# EAGLE design DynoUSB_10 (EAGLE 6.5.0)
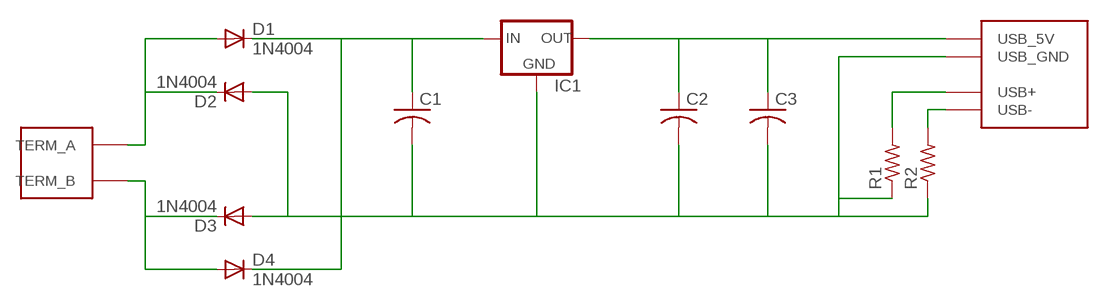
[diagram p0: schematic, sheet 1]

## Parts
C1  C-USC1206  [C1206]
C2  C-USC1206  [C1206]
C3  C-USC3216  [C3216]
D1  1N4004  [DO41-10]
D2  1N4004  [DO41-10]
D3  1N4004  [DO41-10]
D4  1N4004  [DO41-10]
IC1  78XXL  [78XXL]
R1  R-US_M1206  [M1206]
R2  R-US_M1206  [M1206]
U$1  SPARKFUN_USB_A  [USB_4UCON_18666_318]
U$2  SCREW_TERM_2  [SCREWTERMINAL-5MM-2]

## Nets
N$1: D1.A D2.C U$2.1(TERM_A)
N$2: D3.C D4.A U$2.2(TERM_B)
N$3: C2.1 C3.1 IC1.OUT U$1.USB_5V
N$4: C1.1 D1.C D4.C IC1.IN
N$5: C1.2 C2.2 C3.2 D2.A D3.A IC1.GND R1.1 R2.1 U$1.USB_GND
N$6: R1.2 U$1.USB+
N$7: R2.2 U$1.USB-

## Library data of the parts
C1-C3 = rcl:C-US: CAPACITOR, American symbol
D1-D4 = diode:1N4004: DIODE general purpose rectifier, 1 A
IC1 = v-reg:78XXL: VOLTAGE REGULATOR
R1 R2 = resistor:R-US_: RESISTOR, American symbol
U$1 = sparkfun-usb-a:SPARKFUN_USB_A
U$2 = sparkfun-usb-a:SCREW_TERM_2

## Board
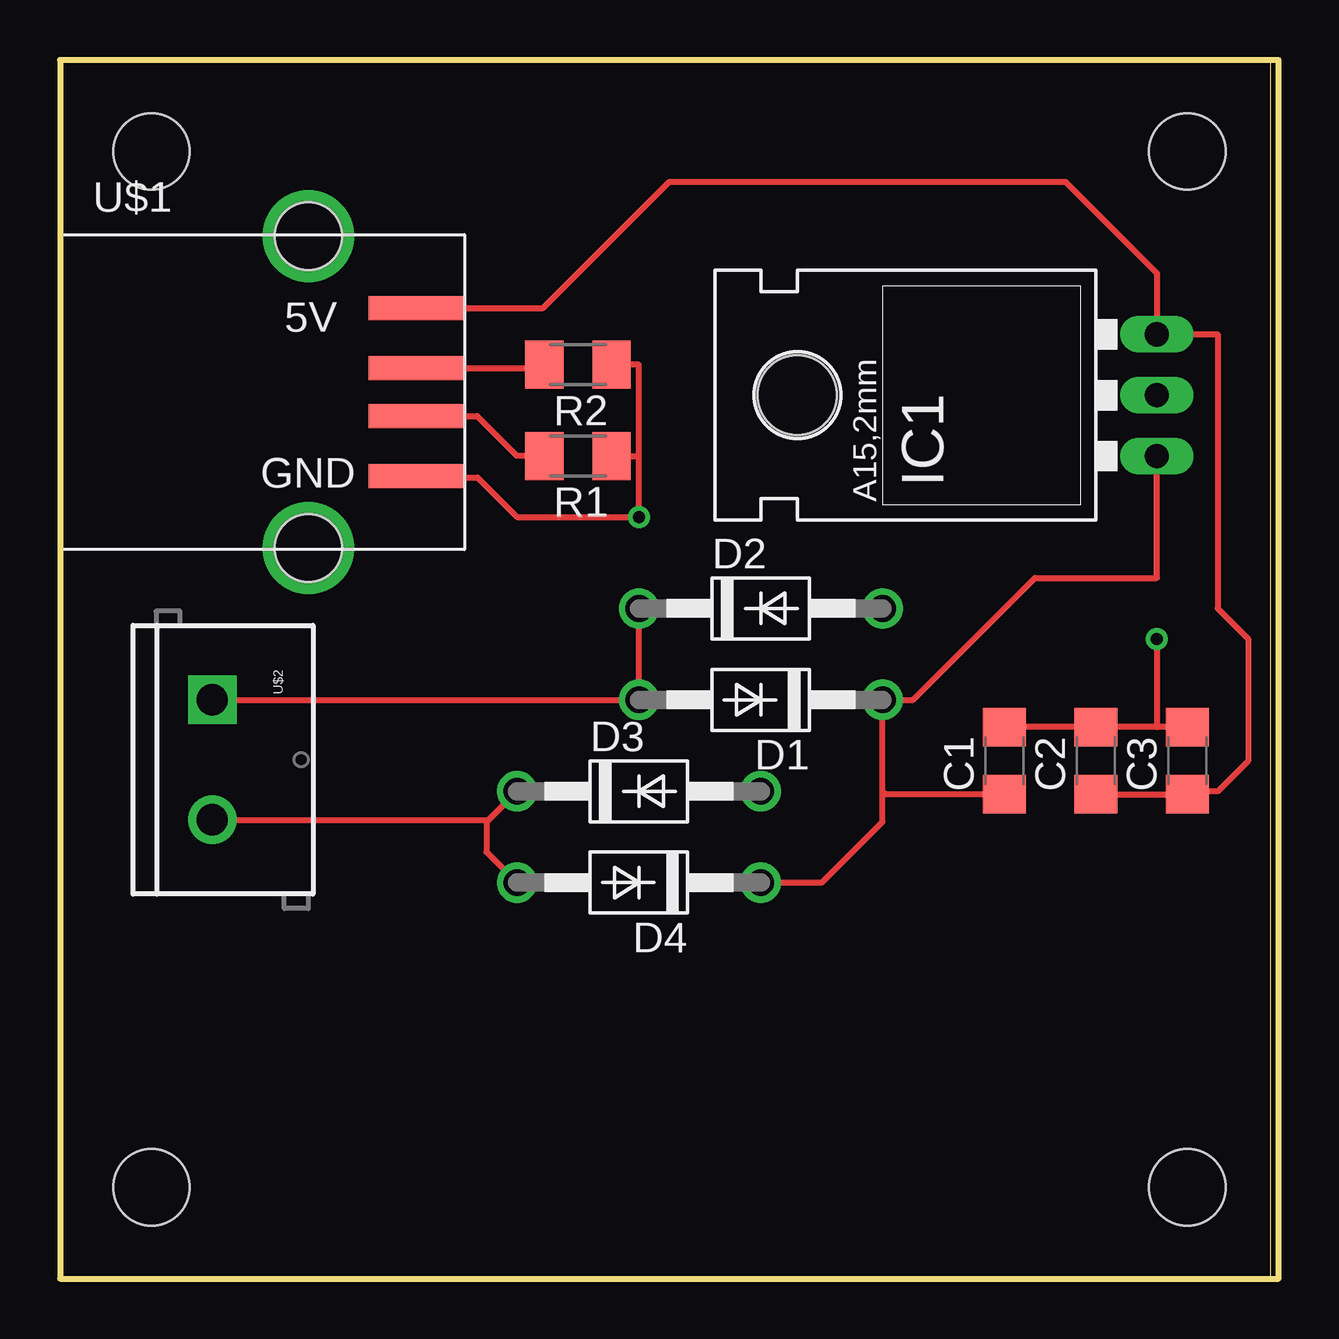
[diagram p1: board, top side]
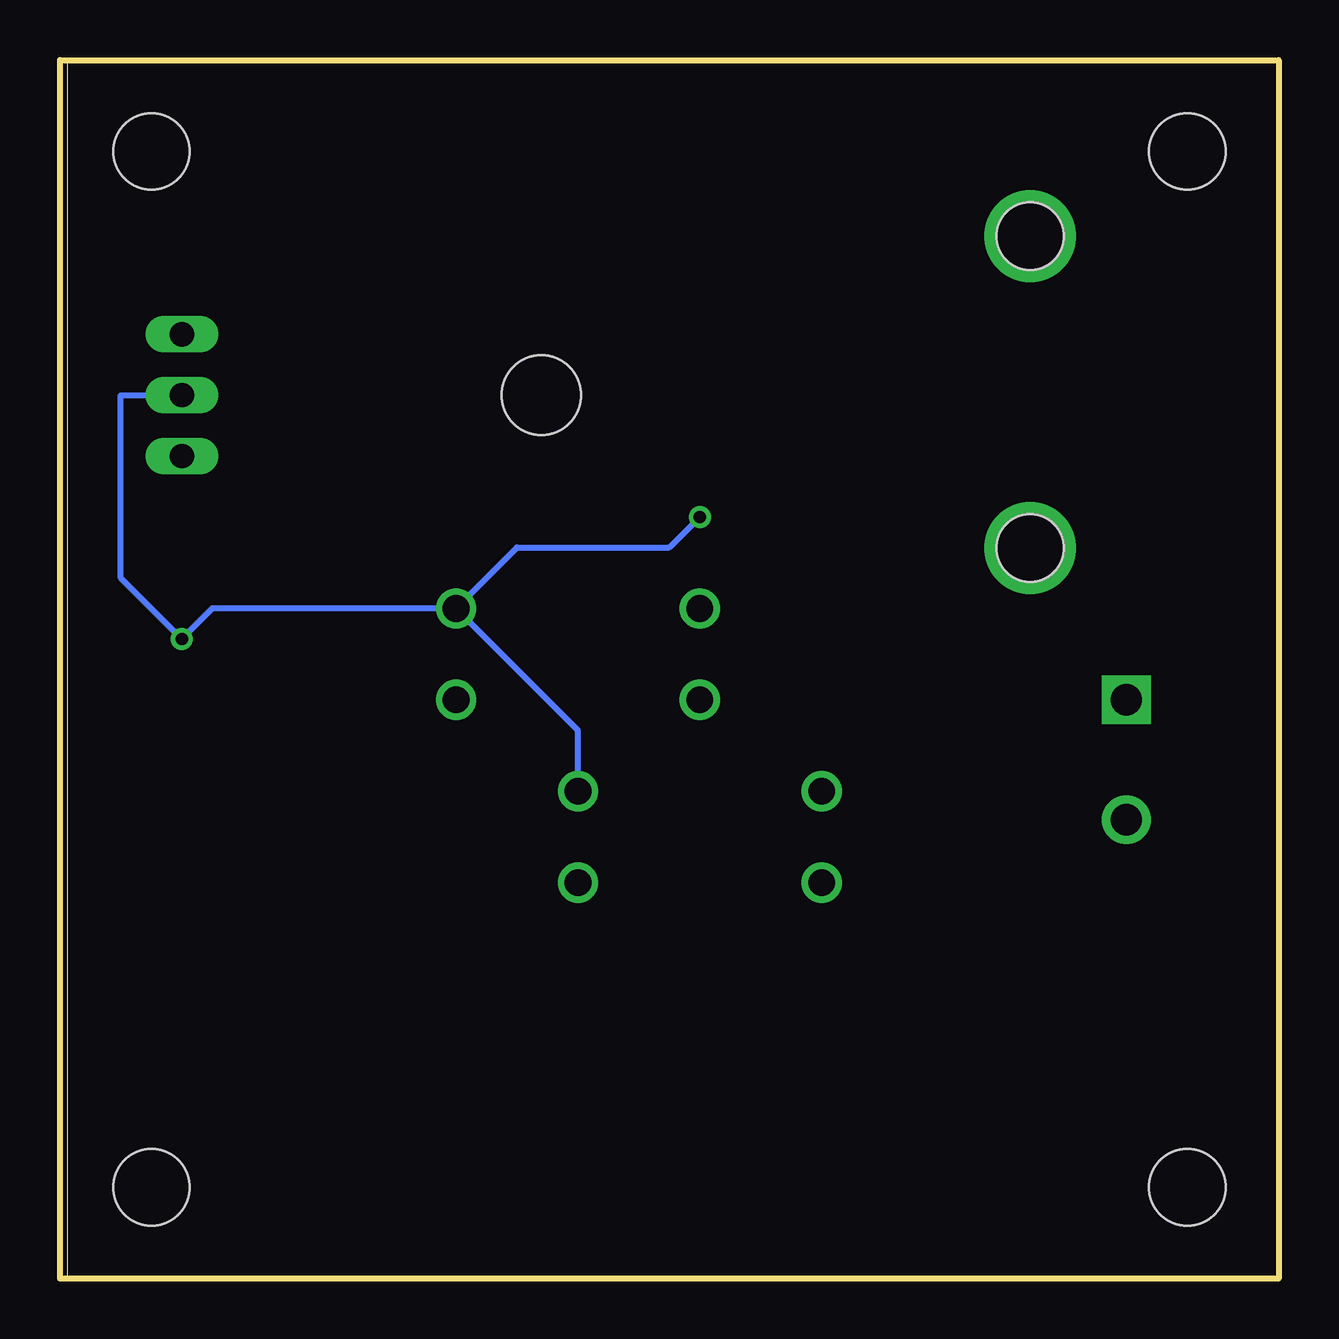
[diagram p2: board, bottom side, seen from below]

Size 50.8 x 50.8 mm. Coordinates in mm from the lower left corner, seen from the top.
Outline: 0,0 50.47,0 50.47,50.79 0,50.79 0,0
Outline: 0,0 0,50.8 50.8,50.8 50.8,0 0,0
Copper layers (1*16): Top 0.035mm / dielectric 1.5mm / Bottom 0.035mm
Design rules "default": minimum track width 10mil, minimum drill 24mil, track to track 8mil, track to pad 8mil, pad to pad 8mil, via to via 8mil, smd to smd 8mil, copper to edge 40mil, drill to drill 8mil, minimum pad ring 10mil, minimum via ring 8mil, stop-mask expansion 4mil, vias tented up to drill 0mil, thermal gap 10mil
Holes 3.17 mm at 3.81,46.99 46.99,46.99 3.81,3.81 46.99,3.81

### Footprints (pad centres in the part's own frame; a part is rotated, then mirrored left to right if it is on the bottom)
C1206 = smd 1.6 x 1.8: 1 -1.4,0; 2 1.4,0
C3216 = smd 1.6 x 1.8: 1 -1.4,0; 2 1.4,0
DO41-10 = drill 1.118: A 5.08,0; C -5.08,0
78XXL = drill 1.016 long: GND 0,-3.81; IN -2.54,-3.81; OUT 2.54,-3.81 | hole 3.302: 0,11.176
M1206 = smd 1.6 x 2: 1 -1.4,0; 2 1.4,0
USB_4UCON_18666_318 = drill 2.8: P$1 -4.5,6.5; P$2 -4.5,-6.5 | smd 4 x 1: USB+ 0,-1; USB- 0,1; USB_5V 0,3.5; USB_GND 0,-3.5 | hole 2.8: -4.5,6.5; -4.5,-6.5
SCREWTERMINAL-5MM-2 = drill 1.3 pad 2.032 square: 1 0,0 | drill 1.3 pad 2.032: 2 5,0

### Placement (x,y rotation side)
C1  39.37,21.59 90 top
C2  43.18,21.59 90 top
C3  46.99,21.59 90 top
D1  29.21,24.13 180 top
D2  29.21,27.94 0 top
D3  24.13,20.32 0 top
D4  24.13,16.51 180 top
IC1  41.91,36.83 90 top
R1  21.59,34.29 180 top
R2  21.59,38.1 180 top
U$1  14.86,36.96 0 top
U$2  6.35,24.13 270 top

### Tracks (layer width: path | path; a pad name or v marks a point on that pad's centre or on a via)
N$1
  Top 0.254: U$2.1 D1.A D2.C
N$2
  Top 0.254: U$2.2 17.86,19.13 D3.C 17.78,19.05 17.78,17.78 D4.A
N$3
  Top 0.254: U$1.USB_5V 20.14,40.46 25.4,45.72 41.91,45.72 45.72,41.91 IC1.OUT 48.26,39.37 48.26,27.94 49.53,26.67 49.53,21.59 48.26,20.32 47.12,20.32 C3.1 | C2.1 C3.1 | C3.1 46.99,20.32
N$4
  Top 0.254: D4.C 31.75,16.51 34.29,19.05 34.29,20.32 | 34.29,20.32 D1.C 35.56,24.13 40.64,29.21 45.72,29.21 IC1.IN | C1.1 34.42,20.19 34.29,20.32
N$5  (via drill 0.51)
  Top 0.254: U$1.USB_GND 14.86,33.4 17.4,33.4 19.05,31.75 v24.13,31.75 24.13,34.29 | 24.13,34.29 24.13,38.1 R2.1 | R1.1 24.13,34.29 | C3.2 45.72,22.99 | 45.72,22.99 C2.2 C1.2 | v45.72,26.67 45.72,22.99
  Bottom 0.254: IC1.GND 48.26,36.83 48.26,29.21 v45.72,26.67 44.45,27.94 D2.A | D2.A 31.75,30.48 25.4,30.48 v24.13,31.75 | D3.A 29.21,22.86 D2.A
N$6
  Top 0.254: R1.2 19.05,34.29 17.38,35.96 U$1.USB+
N$7
  Top 0.254: U$1.USB- 20.05,37.96 R2.2